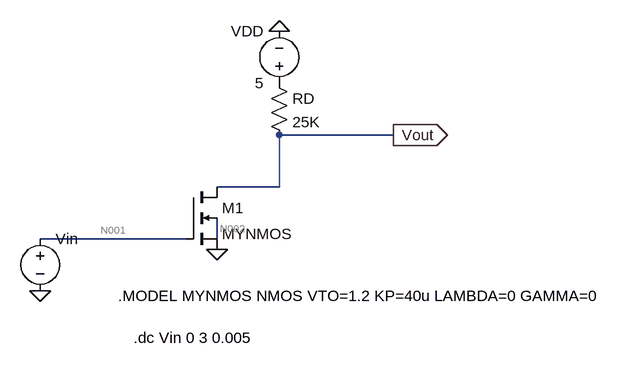
[diagram p0: schematic HW 9 #1a.asc]
HW 9 #1a.asc, the LTspice schematic file:
Version 4
SHEET 1 880 680
WIRE 336 176 160 176
WIRE 160 256 160 176
WIRE 160 256 64 256
WIRE 16 336 -208 336
WIRE 64 336 64 304
FLAG 160 16 0
FLAG 336 176 Vout
IOPIN 336 176 Out
FLAG 64 352 0
FLAG -208 416 0
SYMBOL res 144 80 R0
SYMATTR InstName RD
SYMATTR Value 25K
SYMBOL voltage 160 112 R180
WINDOW 0 24 96 Left 2
WINDOW 3 24 16 Left 2
SYMATTR InstName VDD
SYMATTR Value 5
SYMBOL nmos4 16 256 R0
SYMATTR InstName M1
SYMATTR Value2 l=1u w=100u
SYMATTR Value MYNMOS
SYMBOL voltage -208 320 R0
SYMATTR InstName Vin
SYMATTR Value ""
TEXT -88 424 Left 2 !.MODEL MYNMOS NMOS VTO=1.2 KP=40u LAMBDA=0 GAMMA=0
TEXT -64 488 Left 2 !.dc Vin 0 3 0.005

The netlist it stands for:
* HW 9 #1a.asc
RD P001 Vout 25K
VDD P001 0 5
M1 Vout N001 0 N002 MYNMOS l=1u w=100u
Vin N001 0
.model NMOS NMOS
.model PMOS PMOS
.lib standard.mos
.MODEL MYNMOS NMOS VTO=1.2 KP=40u LAMBDA=0 GAMMA=0
.dc Vin 0 3 0.005
.backanno
.end

* Results of the author's LTspice run, read from the files saved beside the schematic
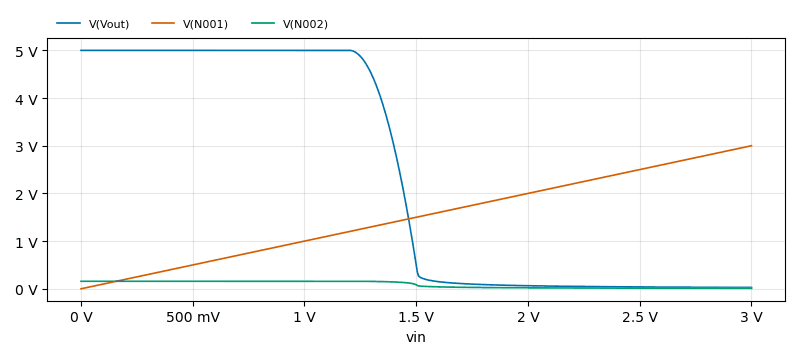
[diagram p1: DC transfer characteristic of HW 9 #1a.asc, plotted from the saved traces]
* DC transfer characteristic, 1 run:
*   V(Vout): 5 V at vin=0 V, 27.84 mV at vin=3 V, min 27.84 mV, max 5 V
*   V(N001): 0 V at vin=0 V, 3 V at vin=3 V, min 0 V, max 3 V
*   V(N002): 158.3 mV at vin=0 V, 9.494 mV at vin=3 V, min 9.494 mV, max 158.3 mV